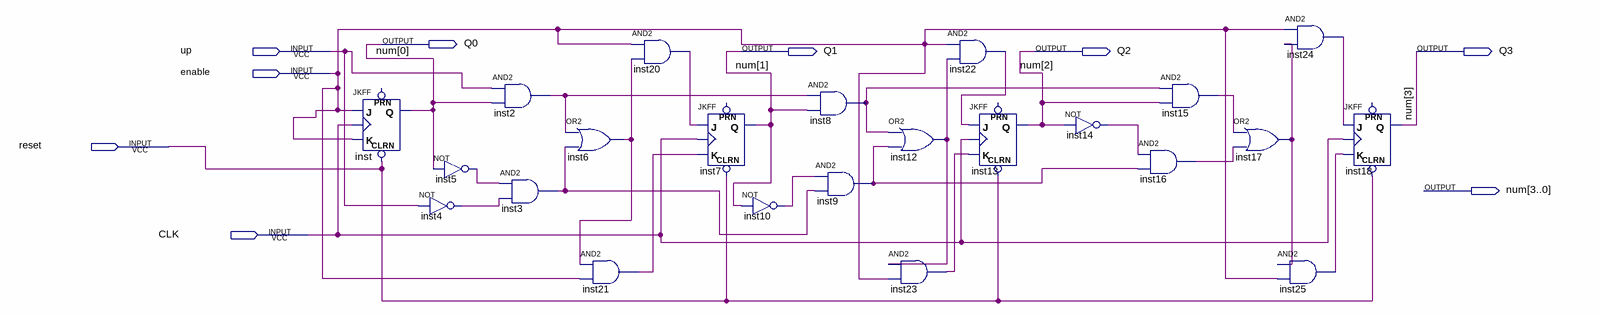
[diagram p0: schematic sheet]
// Quartus schematic counter.bdf as structural Verilog: 23 symbols, 9 pins
module counter (
  input  up,
  input  enable,
  input  reset,
  input  CLK,
  output Q0,
  output Q1,
  output Q2,
  output Q3,
  output [3:0] num
);

  wire inst2_out, inst3_out, inst4_out, inst5_out, inst6_out, inst8_out, inst9_out, inst10_out, inst12_out,
       inst14_out, inst15_out, inst16_out, inst17_out, inst20_out, inst21_out, inst22_out, inst23_out,
       inst24_out, inst25_out;

  JKFF inst (.CLRN(reset), .K(enable), .J(enable), .CLK(CLK), .Q(num[0]));  // open: PRN
  not inst5 (inst5_out, num[0]);
  not inst4 (inst4_out, up);
  and inst2 (inst2_out, up, num[0]);
  and inst3 (inst3_out, inst5_out, inst4_out);
  or inst6 (inst6_out, inst2_out, inst3_out);
  and inst20 (inst20_out, enable, inst6_out);
  and inst21 (inst21_out, inst6_out, enable);
  JKFF inst7 (.CLRN(reset), .K(inst21_out), .J(inst20_out), .CLK(CLK), .Q(num[1]));  // open: PRN
  not inst10 (inst10_out, num[1]);
  and inst8 (inst8_out, inst2_out, num[1]);
  and inst9 (inst9_out, inst10_out, inst3_out);
  or inst12 (inst12_out, inst8_out, inst9_out);
  and inst23 (inst23_out, inst12_out, enable);
  and inst22 (inst22_out, enable, inst12_out);
  JKFF inst13 (.CLRN(reset), .K(inst23_out), .J(inst22_out), .CLK(CLK), .Q(num[2]));  // open: PRN
  not inst14 (inst14_out, num[2]);
  and inst15 (inst15_out, inst8_out, num[2]);
  and inst16 (inst16_out, inst14_out, inst9_out);
  or inst17 (inst17_out, inst15_out, inst16_out);
  and inst25 (inst25_out, inst17_out, enable);
  and inst24 (inst24_out, enable, inst17_out);
  JKFF inst18 (.CLRN(reset), .K(inst25_out), .J(inst24_out), .CLK(CLK), .Q(num[3]));  // open: PRN

  assign Q0 = num[0];
  assign Q1 = num[1];
  assign Q2 = num[2];
  assign Q3 = num[3];
endmodule
